# EAGLE schematic Handheld (EAGLE 9.6.1)
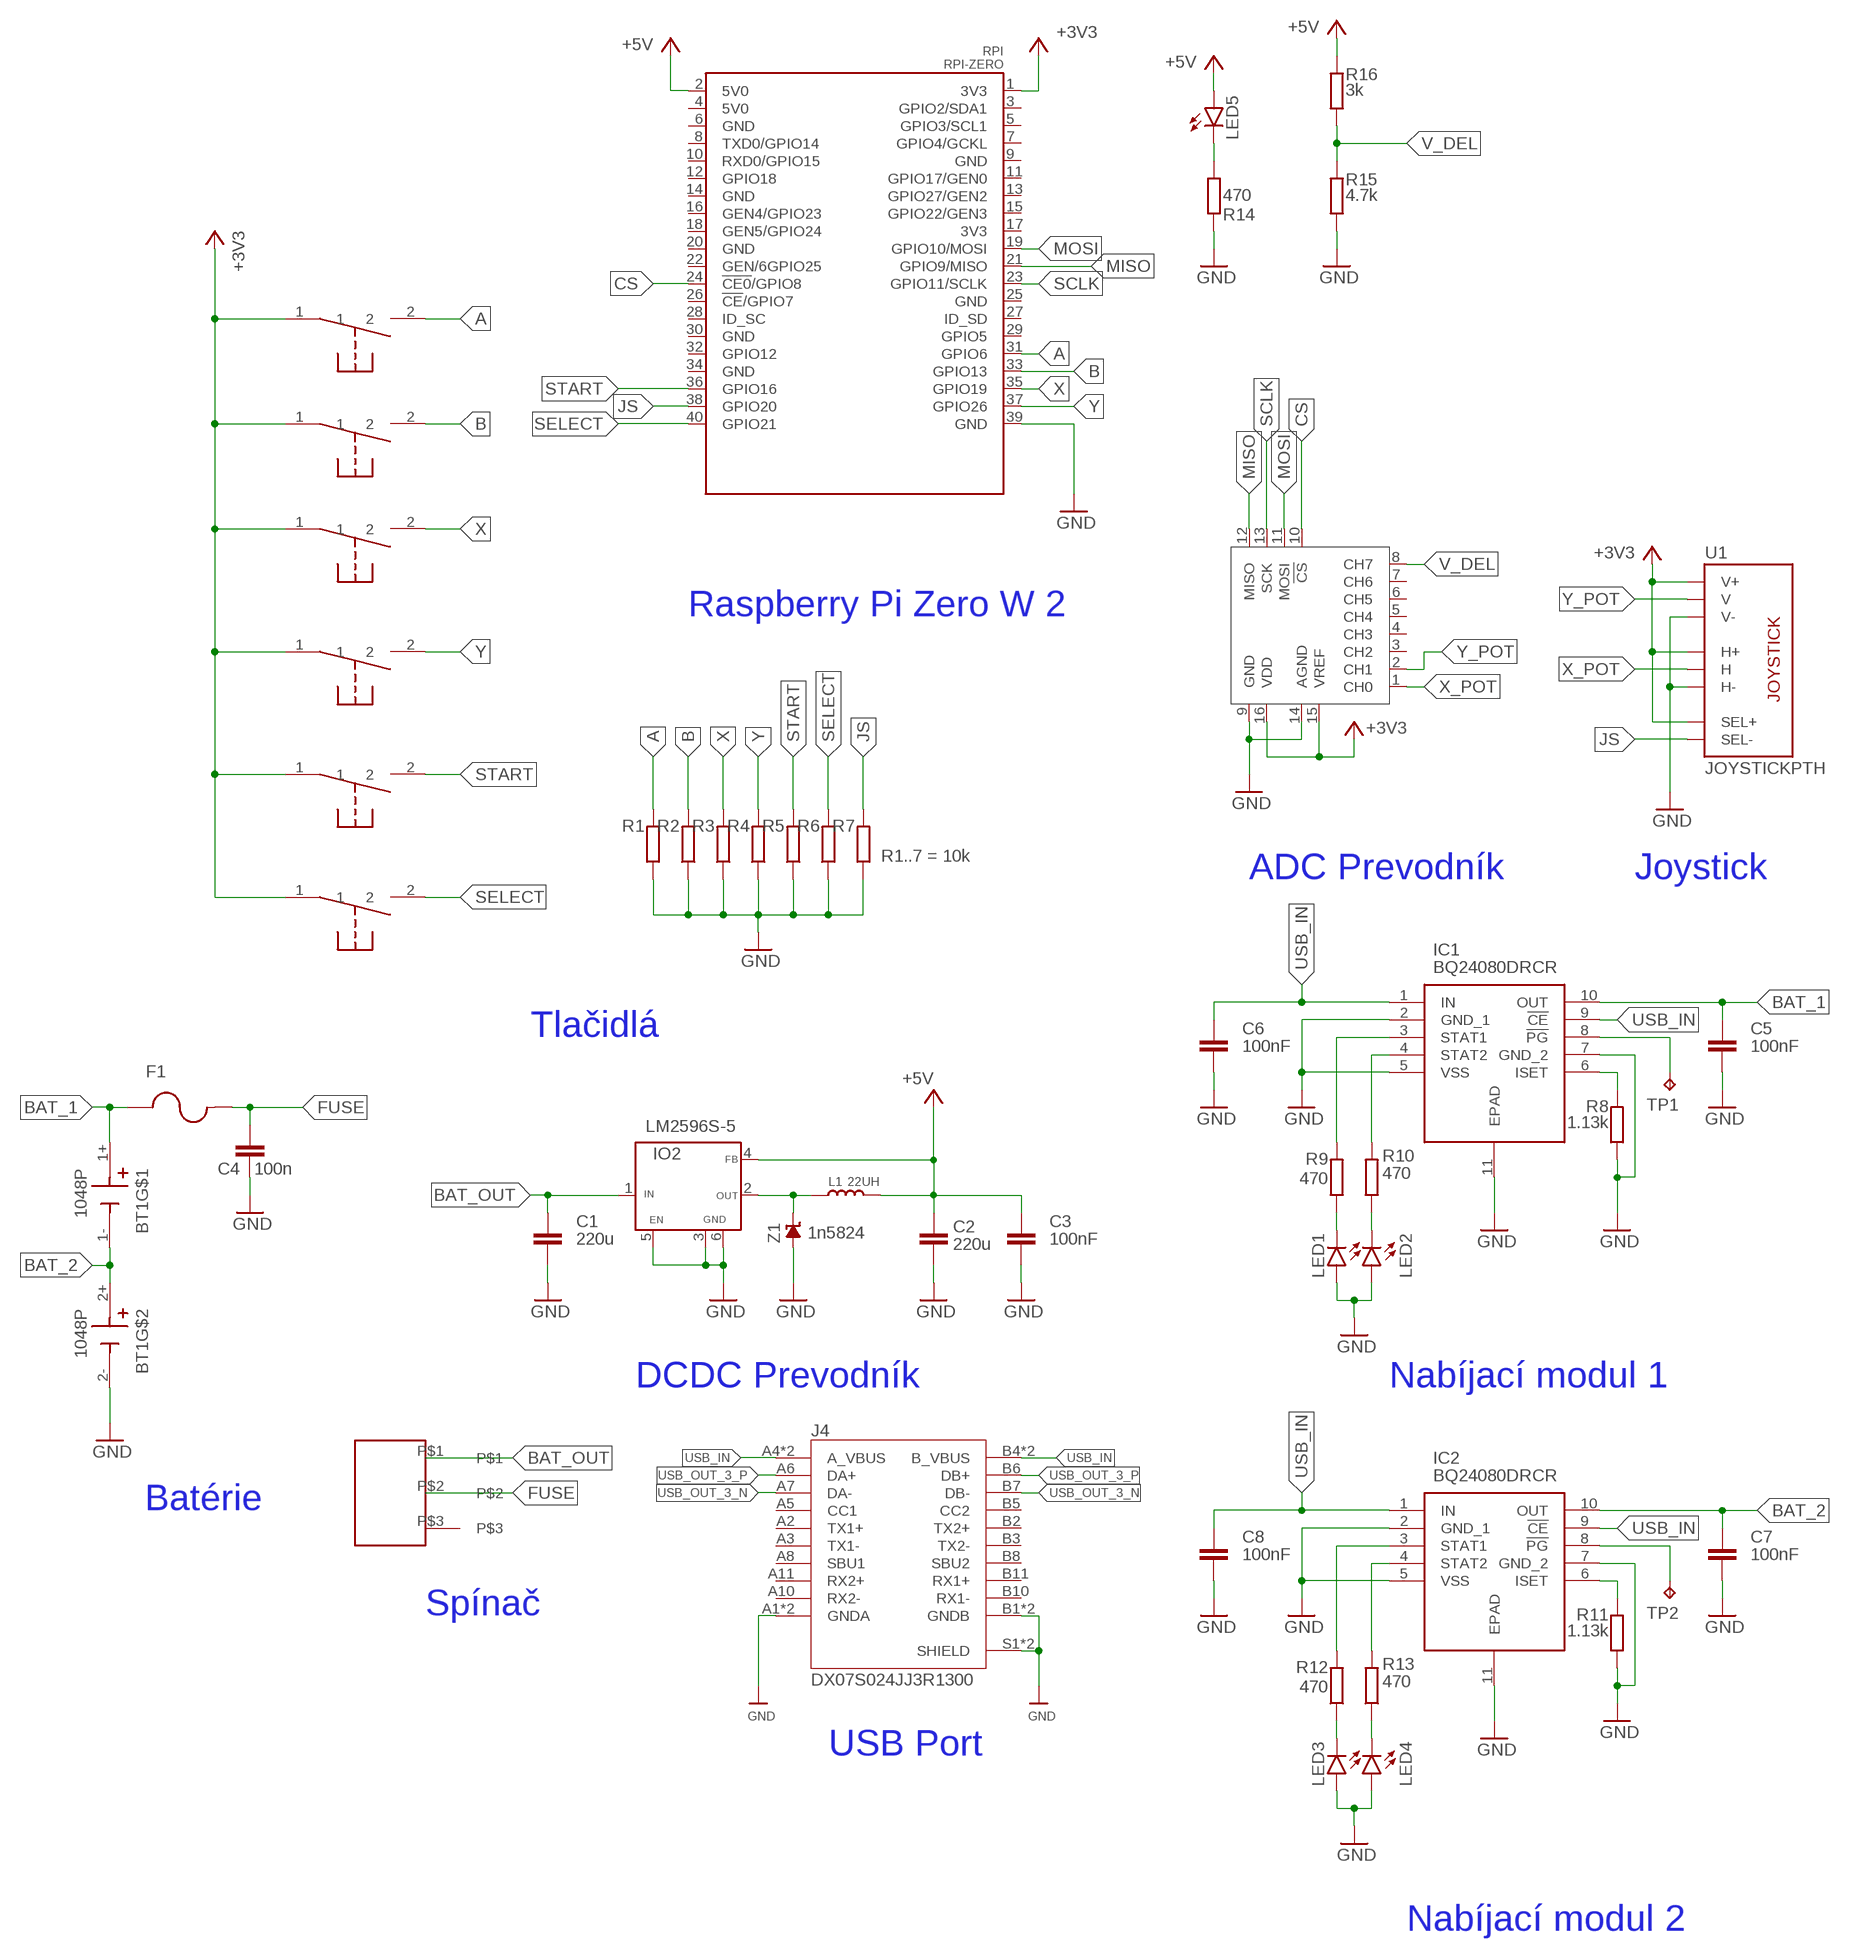
[diagram p0: schematic, sheet 1]

## Parts
BT1  1048P  [BAT_1048P]
C1  220u  C-EUC0603  [C0603]
C2  220u  C-EUC0603  [C0603]
C3  100nF  C-EUC0603  [C0603]
C4  100n  C-EUC0603  [C0603]
C5  100nF  C-EUC0603  [C0603]
C6  100nF  C-EUC0603  [C0603]
C7  100nF  C-EUC0603  [C0603]
C8  100nF  C-EUC0603  [C0603]
F1  5A  3413.0113.22  [3413.0113.22]
IC1  BQ24080DRCR  [SON50P300X300X100-11N]
IC2  BQ24080DRCR  [SON50P300X300X100-11N]
IO2  LM2596S-5  LM2596S  [TO263-5]
J4  DX07S024JJ3R1300  [JAE_DX07S024JJ3R1300]
L1  22UH  INDUCTOR/FERRITE-BEAD0630  [INDUCTOR_L0630]
LED1  LEDCHIP-LED0603  [CHIP-LED0603]
LED2  LEDCHIP-LED0603  [CHIP-LED0603]
LED3  LEDCHIP-LED0603  [CHIP-LED0603]
LED4  LEDCHIP-LED0603  [CHIP-LED0603]
LED5  LEDCHIP-LED0603  [CHIP-LED0603]
R1  470  R-EU_R0603  [R0603]
R2  470  R-EU_R0603  [R0603]
R3  470  R-EU_R0603  [R0603]
R4  470  R-EU_R0603  [R0603]
R5  470  R-EU_R0603  [R0603]
R6  470  R-EU_R0603  [R0603]
R7  470  R-EU_R0603  [R0603]
R8  1.13k  R-EU_R0603  [R0603]
R9  470  R-EU_R0603  [R0603]
R10  470  R-EU_R0603  [R0603]
R11  1.13k  R-EU_R0603  [R0603]
R12  470  R-EU_R0603  [R0603]
R13  470  R-EU_R0603  [R0603]
R14  470  R-EU_R0603  [R0603]
R15  4.7k  R-EU_R0603  [R0603]
R16  3k  R-EU_R0603  [R0603]
RPI  RPI-ZERO  [RASPBERRYPI_BASTELSTUBE_V13_RASPI_BOARD_B+_FULL]
S1  BUTTON  [BUTTON]
S2  BUTTON  [BUTTON]
S3  BUTTON  [BUTTON]
S4  BUTTON  [BUTTON]
S5  BUTTON  [BUTTON]
S6  BUTTON  [BUTTON]
TP1  TPB2,54  [B2,54]
TP2  TPB2,54  [B2,54]
U1  JOYSTICKPTH  [JOYSTICK]
U$3  MCP3008SL  [SO16]
U$10  1P2T  [1P2T]
Z1  1n5824  SUPRESSOR_TVS-UD-SMAJ  [SUPRESSOR_SMAJ]

## Nets
+3V3: RPI.1(3V3) S1.1 S2.1 S3.1 S4.1 S5.1 S6.1 U1.B1A(SEL+) U1.H1(H+) U1.V1(V+) U$3.15(VREF) U$3.16(VDD)
+5V: C2.1 C3.1 IO2.4(FB) L1.2 LED5.A R16.1 RPI.2(5V0)
A: R1.2 RPI.31(GPIO6) S1.2
B: R2.2 RPI.33(GPIO13) S2.2
BAT_1: BT1.1+ C5.1 F1.1 IC1.10(OUT)
BAT_2: BT1.1- BT1.2+ C7.1 IC2.10(OUT)
BAT_OUT: C1.1 IO2.1(IN) U$10.P$1
CS: RPI.24(!CE0!/GPIO8) U$3.10(!CS)
FUSE: C4.2 F1.2 U$10.P$2
GND: BT1.2- C1.2 C2.2 C3.2 C4.1 C5.2 C6.2 C7.2 C8.2 IC1.2(GND_1) IC1.5(VSS) IC1.7(GND_2) IC1.11(EPAD) IC2.2(GND_1) IC2.5(VSS) IC2.7(GND_2) IC2.11(EPAD) IO2.3(GND) IO2.5(EN) IO2.6(GND) J4.A1(GNDA) J4.A12(GNDA) J4.B1(GNDB) J4.B12(GNDB) J4.S1(SHIELD) J4.S2(SHIELD) LED1.A LED2.A LED3.A LED4.A R1.1 R2.1 R3.1 R4.1 R5.1 R6.1 R7.1 R8.1 R11.1 R14.2 R15.2 RPI.39(GND) U1.H3(H-) U1.V3(V-) U$3.9(GND) U$3.14(AGND) Z1.A
JS: R7.2 RPI.38(GPIO20) U1.B2A(SEL-)
MISO: RPI.21(GPIO9/MISO) U$3.12(MISO)
MOSI: RPI.19(GPIO10/MOSI) U$3.11(MOSI)
N$3: LED5.C R14.1
N$5: IC1.6(ISET) R8.2
N$6: IC1.4(STAT2) R10.2
N$7: IC1.3(STAT1) R9.2
N$8: LED1.C R9.1
N$9: LED2.C R10.1
N$11: IC2.6(ISET) R11.2
N$12: IC2.4(STAT2) R13.2
N$13: IC2.3(STAT1) R12.2
N$14: LED3.C R12.1
N$15: LED4.C R13.1
N$16: IC1.8(!PG) TP1.TP
N$17: IC2.8(!PG) TP2.TP
N$61: IO2.2(OUT) L1.1 Z1.C
SCLK: RPI.23(GPIO11/SCLK) U$3.13(SCK)
SELECT: R6.2 RPI.40(GPIO21) S6.2
START: R5.2 RPI.36(GPIO16) S5.2
USB_IN: C6.1 C8.1 IC1.1(IN) IC1.9(!CE) IC2.1(IN) IC2.9(!CE) J4.A4(A_VBUS) J4.A9(A_VBUS) J4.B4(B_VBUS) J4.B9(B_VBUS)
USB_OUT_3_N [90R_dif]: J4.A7(DA-) J4.B7(DB-)
USB_OUT_3_P [90R_dif]: J4.A6(DA+) J4.B6(DB+)
V_DEL: R15.1 R16.2 U$3.8(CH7)
X: R3.2 RPI.35(GPIO19) S3.2
X_POT: U1.H2(H) U$3.1(CH0)
Y: R4.2 RPI.37(GPIO26) S4.2
Y_POT: U1.V2(V) U$3.2(CH1)
Unconnected: J4.A2(TX1+) J4.A3(TX1-) J4.A5(CC1) J4.A8(SBU1) J4.A10(RX2-) J4.A11(RX2+) J4.B2(TX2+) J4.B3(TX2-) J4.B5(CC2) J4.B8(SBU2) J4.B10(RX1-) J4.B11(RX1+) RPI.3(GPIO2/SDA1) RPI.4(5V0) RPI.5(GPIO3/SCL1) RPI.6(GND) RPI.7(GPIO4/GCKL) RPI.8(TXD0/GPIO14) RPI.9(GND) RPI.10(RXD0/GPIO15) RPI.11(GPIO17/GEN0) RPI.12(GPIO18) RPI.13(GPIO27/GEN2) RPI.14(GND) RPI.15(GPIO22/GEN3) RPI.16(GEN4/GPIO23) RPI.17(3V3) RPI.18(GEN5/GPIO24) RPI.20(GND) RPI.22(GEN/6GPIO25) RPI.25(GND) RPI.26(!CE!/GPIO7) RPI.27(ID_SD) RPI.28(ID_SC) RPI.29(GPIO5) RPI.30(GND) RPI.32(GPIO12) RPI.34(GND) U$3.3(CH2) U$3.4(CH3) U$3.5(CH4) U$3.6(CH5) U$3.7(CH6) U$10.P$3

## Notes on the sheet
- Raspberry Pi Zero W 2
- R1..7 = 10k
- ADC Prevodník | Joystick
- Tlačidlá
- DCDC Prevodník | Nabíjací modul 1
- Batérie
- Spínač
- USB Port
- Nabíjací modul 2

## Library data of the parts
BT1 = 1048P:1048P: Battery Holder (Open) 18650 2 Cell SMD (SMT) Tab Check prices <https://pricing.snapeda.com/parts/1048P/Keystone%20Electronics/view-part?ref=eda>; AVAILABILITY: In Stock; DESCRIPTION: SMT Polarized Holder for Dual 18650 Batteries; MF: Keystone Electronics; MP: 1048P; PACKAGE: None; PRICE: None
C1-C8 = rcl:C-EU: CAPACITOR, European symbol; SPICEPREFIX: C
F1 = Fuse:3413.0113.22: FUSE BOARD MNT 500MA 125VAC/VDC Manufacturer's datasheet <https://us.schurter.com/bundles/snceschurter/epim/_ProdPool_/newDS/en/typ_USF_1206.pdf>; CREATED_BY: PCBLayout.com; DIGIKEY_PARTNO: 486-1675-2-ND; MANUFACTURER: Schurter Inc.; MPN: 3413.0113.22
IC1 IC2 = BQ24080DRCR:BQ24080DRCR: 1-cell Li-Ion Charger w/ 1-A FET, AC Present and Charge Enable Source: Datasheet <http://www.ti.com/lit/gpn/bq24080>; DESCRIPTION: 1-cell Li-Ion Charger w/ 1-A FET, AC Present and Charge Enable; HEIGHT: 1mm; MANUFACTURER_NAME: Texas Instruments; MANUFACTURER_PART_NUMBER: BQ24080DRCR; MOUSER_PART_NUMBER: 595-BQ24080DRCR; MOUSER_PRICE-STOCK: https://www.mouser.co.uk/ProductDetail/Texas-Instruments/BQ24080DRCR?qs=LgZHeZZt5MU%2FyDpF9dIpWg%3D%3D
IO2 = TABOR K1:LM2596: DC/DC pulzny regulator STEP-DOWN / 3A upraveny podla katalogu
J4 = DX07S024JJ3R1300_OK:DX07S024JJ3R1300: top mount dual row SMT receptacle, 24 position, non-shielded, 1300 pcs/reel; DESCRIPTION: USB-C (USB TYPE-C) USB 3.2 Gen 2 (USB 3.1 Gen 2, Superspeed + (USB 3.1)) Receptacle Connector 24 Position Surface Mount, Right Angle; Through Hole; DIGI-KEY_PART_NUMBER: 670-2846-1-ND; MF: JAE Electronics; MP: DX07S024JJ3R1300; PACKAGE: None; PURCHASE-URL: https://pricing.snapeda.com/search/part/DX07S024JJ3R1300/?ref=eda
L1 = BeagleBone_Blue_R3:INDUCTOR/FERRITE-BEAD
LED1-LED5 = led:LED: LED OSRAM: - CHIPLED LG R971, LG N971, LY N971, LG Q971, LY Q971, LO R971, LY R971 LH N974, LH R974 LS Q976, LO Q976, LY Q976 LO Q996 - Hyper CHIPLED LW Q18S LB Q993, LB Q99A, LB R99A - SideLED LS A670, LO A670, LY A670, LG A670, LP A670 LB A673, LV A673, LT A673, LW A673 LH A674 LY A675 LS A676, LA A676, LO A676, LY A676, LW A676 LS A679, LY A679, LG A679 - Hyper Micro SIDELED® LS Y876, LA Y876, LO Y876, LY Y876 LT Y87S - SmartLED LW L88C, LW L88S LB L89C, LB L89S, LG L890 LS L89K, LO L89K, LY L89K LS L896, LA L896, LO L896, LY L896 - TOPLED LS T670, LO T670, LY T670, LG T670, LP T670 LSG T670, LSP T670, LSY T670, LOP T670, LYG T670 LG T671, LOG T671, LSG T671 LB T673, LV T673, LT T673, LW T673 LH T674 LS T676, LA T676, LO T676, LY T676, LB T676, LH T676, LSB T676, LW T676 LB T67C, LV T67C, LT T67C, LS T67K, LO T67K, LY T67K, LW E67C LS E67B, LA E67B, LO E67B, LY E67B, LB E67C, LV E67C, LT E67C LW T67C LS T679, LY T679, LG T679 LS T770, LO T770, LY T770, LG T770, LP T770 LB T773, LV T773, LT T773, LW T773 LH T774 LS E675, LA E675, LY E675, LS T675 LS T776, LA T776, LO T776, LY T776, LB T776 LHGB T686 LT T68C, LB T68C - Hyper Mini TOPLED® LB M676 - Mini TOPLED Santana® LG M470 LS M47K, LO M47K, LY M47K Source: http://www.osram.convergy.de LUXEON: - LUMILED® LXK2-PW12-R00, LXK2-PW12-S00, LXK2-PW14-U00, LXK2-PW14-V00 LXK2-PM12-R00, LXK2-PM12-S00, LXK2-PM14-U00 LXK2-PE12-Q00, LXK2-PE12-R00, LXK2-PE12-S00, LXK2-PE14-T00, LXK2-PE14-U00 LXK2-PB12-K00, LXK2-PB12-L00, LXK2-PB12-M00, LXK2-PB14-N00, LXK2-PB14-P00, LXK2-PB14-Q00 LXK2-PR12-L00, LXK2-PR12-M00, LXK2-PR14-Q00, LXK2-PR14-R00 LXK2-PD12-Q00, LXK2-PD12-R00, LXK2-PD12-S00 LXK2-PH12-R00, LXK2-PH12-S00 LXK2-PL12-P00, LXK2-PL12-Q00, LXK2-PL12-R00 Source: www.luxeon.com KINGBRIGHT: KA-3528ASYC Source: www.kingbright.com
R1-R16 = rcl:R-EU_: RESISTOR, European symbol; SPICEPREFIX: R
RPI = RPI-Zero:RPI-ZERO
S1-S6 = Button1:BUTTON
TP1 TP2 = testpad:TP: Test pad
U1 = adafruit:JOYSTICK: Thumb Joystick Joystick commonly found in PS2 controllers. Two pots and a select switch. Adapted from Sparkfun Library (but for more common 6mm switch sticks)
U$3 = MCP3008:MCP3008
U$10 = TABOR K1:1P2T
Z1 = 52101-101-REV-A:SUPRESSOR_TVS-UD-: TVS UNI-DIRECTIONAL

## Net classes
2 90R_dif: width 0.147 mm, drill 0.25 mm, clearance 0.253 mm